# Altium project 红外发射.PrjPCB
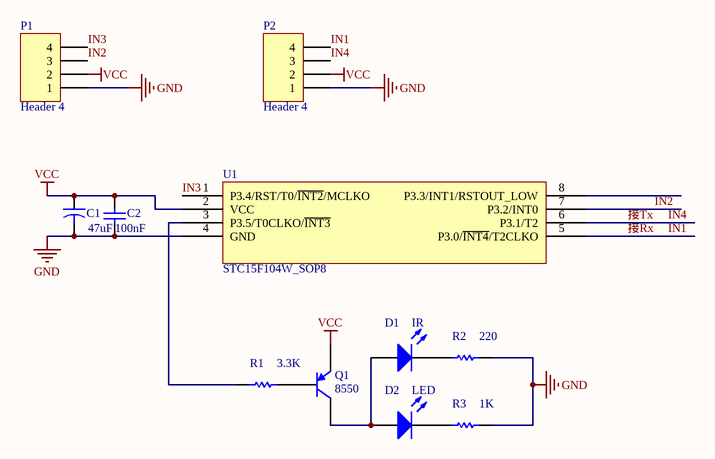
[diagram p0: 红外发射.SchDoc]
1 sheet, 11 parts. Net scope: global (net labels, ports and power ports of the same name join across sheets).
Board file: 红外发射.PcbDoc

## Sheet 红外发射.SchDoc: BOXZ红外发射模块
size A4; Revision: V1.0; PageSetup: Record=PageOptions|CenterHorizontal=True|CenterVertical=True|PrintScale=1.00|XCorrection=1.00|YCorrection=1.00|PrintKind=0|BorderSize=5000000|LeftOffset=0|BottomOffset=0|Orientation=2|PaperLength=1000|PaperWidth=1000|Scale=100|PaperSource=7|PrintQuality=-4|MediaType=1|DitherType=10|PaperKind=A4|PrintScaleMode=1; Time: 2014/7/16

### Parts
C1  value 47uF  [C1210_L]  (hidden comment: Cap2)
C2  value 100nF  [6-0805_N]  (hidden comment: Cap)
D1  IR  [PIN2]
D2  LED  [6-0805_N]
P1  Header 4  [HDR1X4]
P2  Header 4  [HDR1X4]
Q1  8550  [SOT-23_N]
R1  value 3.3K  [6-0805_N]  (hidden comment: Res1)
R2  value 220  [6-0805_N]  (hidden comment: Res1)
R3  value 1K  [6-0805_N]  (hidden comment: Res1)
U1  STC15F104W_SOP8  [DFN8]

### Nets
GND: C1.2 C2.1 P1.1 P2.1 R2.2 R3.2 U1.4(GND)
VCC: C1.1 C2.2 P1.2 P2.2 Q1.1(E) U1.2(VCC)
IN1: P2.4 U1.5(P3.0/~{INT4}/T2CLKO)  [also labelled 接Rx]
IN2: P1.3 U1.7(P3.2/INT0)
IN3: P1.4 U1.1(P3.4/RST/T0/~{INT2}/MCLKO)
IN4: P2.3 U1.6(P3.1/T2)  [also labelled 接Tx]
NetD1_1: D1.1(A) D2.1(A) Q1.3(C)
NetD1_2: D1.2(K) R2.1
NetD2_2: D2.2(K) R3.1
NetQ1_2: Q1.2(B) R1.2
NetR1_1: R1.1 U1.3(P3.5/T0CLKO/~{INT3})

Not connected (* = marked no-connect by the designer): U1 8(P3.3/INT1/RSTOUT_LOW)

### Library data of the parts
C1 = Cap2: Capacitor; Published: 23-Sep-2002; PackageReference: CAPR5-4X5; Publisher: Altium Limited; PackageDescription: Capacitor; 2 Leads
C2 = Cap: Capacitor; Published: 8-Jun-2000; LatestRevisionDate: 17-Jul-2002; LatestRevisionNote: Re-released for DXP Platform.; PackageReference: RAD-0.3; Publisher: Altium Limited; PackageDescription: Radial Cap, Thru-Hole; 2 Leads; 0.3 in Pin Spacing
D1 D2 = LED0: Typical INFRARED GaAs LED; Published: 8-Jun-2000; LatestRevisionDate: 08-Jul-2005; LatestRevisionNote: Mech Layer 1 removed.; PackageReference: LED-0; Publisher: Altium Limited; PackageDescription: LED; 2 Leads
P1 P2 = Header 4: Header, 4-Pin; LatestRevisionDate: 17-Jul-2002; LatestRevisionNote: Re-released for DXP Platform.; Publisher: Altium Limited
Q1 = 2N3906: PNP General Purpose Amplifier; pin to pad: 1>2 2>1; Published: 8-Jun-2000; LatestRevisionDate: 15-Jan-2003; LatestRevisionNote: PCB Footprint 'BCY-W3/D4.7' replaced; DatasheetVersion: 1997; PackageVersion: Sep-1998; PackageReference: TO-92A; Publisher: Altium Limited; PackageDescription: TO, Flat Index; 3 In-Line, Axial Leads; Body Dia. 4.5mm; Leads 0.51 x 0.48 mm (max); ComponentLink1Description: Manufacturer Link; ComponentLink1URL: http://www.fairchildsemi.com/; ComponentLink2Description: Datasheet; ComponentLink2URL: http://www.fairchildsemi.com/ds/2N%2F2N3906.pdf
R1-R3 = Res1: Resistor; Published: 8-Jun-2000; LatestRevisionDate: 17-Jul-2002; LatestRevisionNote: Re-released for DXP Platform.; PackageReference: AXIAL-0.3; Publisher: Altium Limited; PackageDescription: Axial Device, Thru-Hole; 2 Leads; 0.3 in Pin Spacing
U1 = STC15F101W_SOP8_DIP8